# EasyEDA Pro project TLV3501.eprj

# Schematic Schematic1
Create Date: 2023-01-22; Page Name: P1; Project Name: TLV3501; Schematic Name: Schematic1; Update Date: 2023-02-03; Company: 嘉立创EDA
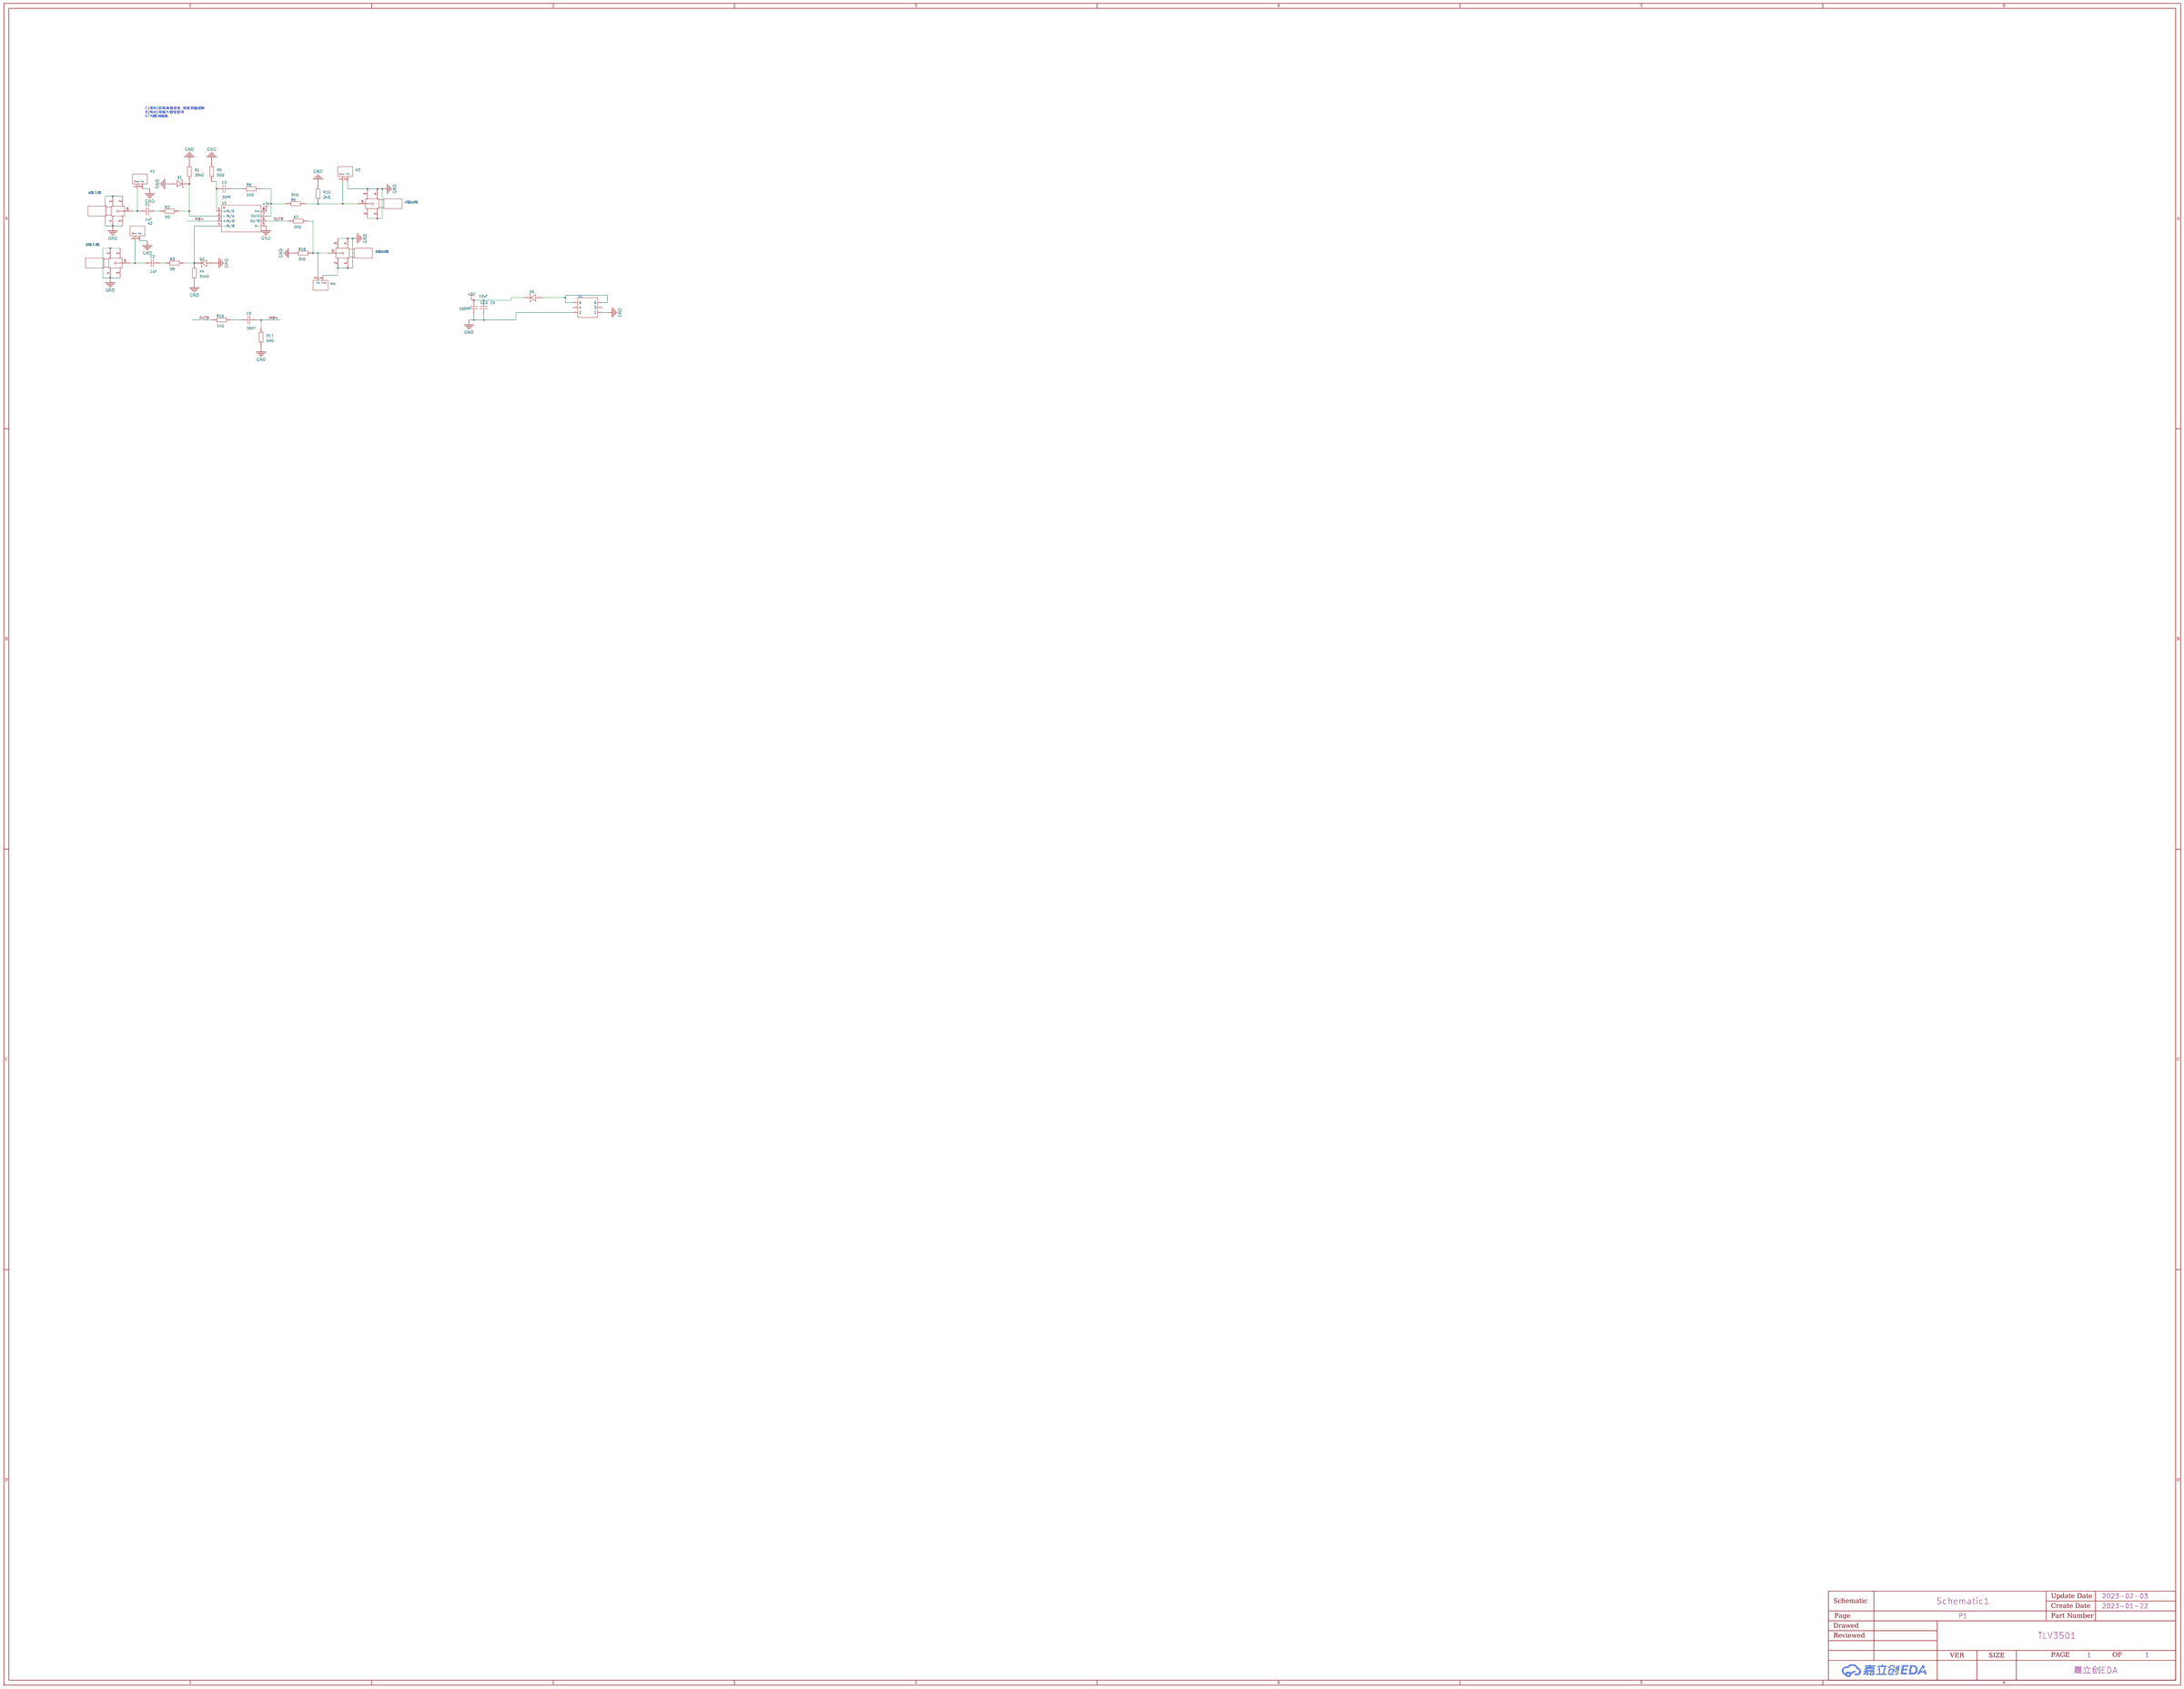
[diagram p0: schematic sheet]

## Parts
A输入端  BWSMA-KE-P001  [SMA-SMD_BWSMA-KE-P001]
A输出端  BWSMA-KE-P001  [SMA-SMD_BWSMA-KE-P001]
B输入端  BWSMA-KE-P001  [SMA-SMD_BWSMA-KE-P001]
B输出端  BWSMA-KE-P001  [SMA-SMD_BWSMA-KE-P001]
C1  1uF  [C0805]
C2  1uF  [C0805]
C3  30PF  [C0805]
C5  30PF  [C0805]
C6  10uf  [C0805]
C10  100Nf  [C0805]
D1  BAS40WS 43  [SOD-323_L1.8-W1.3-LS2.5-RD]
D2  BAS40WS 43  [SOD-323_L1.8-W1.3-LS2.5-RD]
D5  BAS40WS 43  [SOD-323_L1.8-W1.3-LS2.5-RD]
H1  PZ254V-11-02P  [HDR-TH_2P-P2.54-V-M]
H2  PZ254V-11-02P  [HDR-TH_2P-P2.54-V-M]
H3  PZ254V-11-02P  [HDR-TH_2P-P2.54-V-M]
H4  PZ254V-11-02P  [HDR-TH_2P-P2.54-V-M]
J1  2.54-2*3P针  [HDR-TH_6P-P2.54-V-M-R2-C3-S2.54-1]
R1  30kΩ  [R0805]
R2  0Ω  [R0805]
R3  0Ω  [R0805]
R4  30kΩ  [R0805]
R6  3KΩ  [R0805]
R7  3KΩ  [R0805]
R8  1kΩ  [R0805]
R9  50Ω  [R0805]
R10  2kΩ  [R0805]
R16  1kΩ  [R0805]
R17  50Ω  [R0805]
R18  2kΩ  [R0805]
U1  TLV3502AIDR  [SOIC-8_L4.9-W3.9-P1.27-LS6.0-BL]

## Library data of the parts
A输入端 A输出端 B输入端 B输出端 = BWSMA-KE-P001: 连接器类型:板端;射频系列:SMA;接口类型:内孔;端口数量:1;阻抗:-;频率-最大值:-;样式:偏脚;接口直径:5.2mm;接口长度/高度:-;工作温度范围:-;; LCSC Part Name: SMA 内孔 偏脚 SMA偏脚板端座子; Supplier Part: C496550; Manufacturer: BAT WIRELESS(蝙蝠无线); Supplier Footprint: 插件; JLCPCB Part Class: Extended Part; Datasheet: https://atta.szlcsc.com/upload/public/pdf/source/20200416/C496550_06668BF2E3B968EA39F96D17E7156373.pdf; Supplier: LCSC; Connector Type: 板端; RF Series: SMA; Interface Type: 内孔; Number of Ports: 1; Style: 偏脚; Interface Diameter: 5.2mm
C1-C3 C5 = CL21B225KAFNNNE: 容值:2.2uF;精度:±10%;额定电压:25V;材质(温度系数):X7R;; LCSC Part Name: 2.2uF ±10% 25V; Supplier Part: C19110; Manufacturer: SAMSUNG(三星); Supplier Footprint: 0805; JLCPCB Part Class: Extended Part; Datasheet: https://atta.szlcsc.com/upload/public/pdf/source/20160103/1457707702018.pdf; Supplier: LCSC; Tolerance: ±10%; Voltage Rated: 25V; Temperature Coefficient: X7R
C6 C10 = CC0805KRX7R9BB104: 容值:100nF;精度:±10%;额定电压:50V;材质(温度系数):X7R;; LCSC Part Name: 100nF ±10% 50V; Supplier Part: C49678; Manufacturer: YAGEO(国巨); Supplier Footprint: 0805; JLCPCB Part Class: Basic Part; Datasheet: https://atta.szlcsc.com/upload/public/pdf/source/20151026/1457707504898.pdf; Supplier: LCSC; Tolerance: ±10%; Voltage Rated: 50V; Temperature Coefficient: X7R
D1 D2 D5 = BAS40WS 43: 直流反向耐压(Vr):40V;平均整流电流(Io):200mA;正向压降(Vf):1V@40mA;; LCSC Part Name: 40V 200mA 1V@40mA; Supplier Part: C22648; Manufacturer: CJ(江苏长电/长晶); Supplier Footprint: SOD-323; JLCPCB Part Class: Extended Part; Datasheet: https://atta.szlcsc.com/upload/public/pdf/source/20161217/1481939122594.pdf; Supplier: LCSC; Reverse Voltage (Vr): 40V; Average Rectified Current (Io): 200mA; Forward Voltage (Vf@If): 1V@40mA
H1-H4 = PZ254V-11-02P: 排数:单排;总PIN位数:2;间距:2.54mm;插针结构:1x2P;行距:-;安装类型:直插;圆针/方针:方针;额定电流:-;额定电压:-;配合针长度:6mm;塑高:2.5mm;端接针长度:3mm;触头材质:黄铜;触头镀层:-;工作温度范围:-40~+105;颜色:黑色;; LCSC Part Name: 2.54mm 1x2P 直插 方针; Supplier Part: C492401; Manufacturer: XFCN(兴飞); Supplier Footprint: 直插,P=2.54mm; JLCPCB Part Class: Extended Part; Datasheet: https://atta.szlcsc.com/upload/public/pdf/source/20200309/C492401_A812433581A9B211A7FFA413ADDFF0E5.pdf; Supplier: LCSC; Number of Rows: 单排; Number of Pins: 2; Pitch: 2.54mm; Pin Structure: 1x2P; Mounting Type: 直插; Circluar Pins/Square Pins: 方针; Length of Mating Pin: 6mm; Insulation Height: 2.5mm; Length of End Connection Pin: 3mm; Contact Material: 黄铜; Operating Temperature Range: -40~+105; Color: 黑色
J1 = 2.54-2*3P针: 排数:双排;总PIN位数:6;间距:2.54mm;插针结构:-;行距:-;安装类型:直插;圆针/方针:-;额定电流:-;额定电压:-;配合针长度:-;塑高:-;触头材质:-;触头镀层:-;颜色:黑色;; LCSC Part Name: 2.54mm 直插; Supplier Part: C65114; Manufacturer: BOOMELE(博穆精密); Supplier Footprint: 插件,P=2.54mm; JLCPCB Part Class: Extended Part; Supplier: LCSC; Number of Rows: 双排; Number of Pins: 6; Pitch: 2.54mm; Mounting Type: 直插; Color: 黑色
R1-R4 R6-R10 R16-R18 = 0805W8F1002T5E_C17414: 电阻类型:厚膜电阻;阻值:10kΩ;精度:±1%;功率:125mW;温度系数:±100ppm/;最大工作电压:150V;工作温度范围:-55~+155;; LCSC Part Name: 10kΩ ±1% 125mW; Supplier Part: C17414; Manufacturer: UNI-ROYAL(厚声); Manufacturer Part: 0805W8F1002T5E; Supplier Footprint: 0805; JLCPCB Part Class: Basic Part; Datasheet: https://atta.szlcsc.com/upload/public/pdf/source/20200306/C422600_1E6D84923E4A46A82E41ADD87F860B5C.pdf; Supplier: LCSC; Type: 厚膜电阻; Tolerance: ±1%; Power(Watts): 125mW; Temperature Coefficient: ±100ppm/; Overload Voltage (Max): 150V; Operating Temperature Range: -55~+155
U1 = TLV3502AIDR: TLV3502 4.5ns 轨至轨比较器; Supplier Part: C131165; Manufacturer: TI(德州仪器); Supplier Footprint: SOIC-8; JLCPCB Part Class: Extended Part; Datasheet: https://atta.szlcsc.com/upload/public/pdf/source/20171026/C131165_15089839567681058795.pdf; Supplier: LCSC

## Nets
+5V: C6.2 C10.2 D5.1(K) U1.8(V+)
GND: A输入端.1 A输入端.2 A输入端.3 A输入端.4 A输出端.1 A输出端.2 A输出端.3 A输出端.4 B输入端.1 B输入端.2 B输入端.3 B输入端.4 B输出端.1 B输出端.2 B输出端.3 B输出端.4 C6.1 C10.1 D1.2(A) D2.2(A) H1.2 H2.2 H3.2 H4.1 J1.1 J1.2 R1.1 R4.1 R9.1 R10.1 R17.1 R18.1 U1.5(V-)
INB+: C5.1 R17.2 U1.3(+IN/B)
OUTB: R7.1 R16.2 U1.6(OUTB)
$1N945: C1.2 R2.2
$1N1315: C2.2 R3.2
$1N14477: C3.2 R8.1
$1N15857: C5.2 R16.1
Net-(A输入端-5): A输入端.5 C1.1 H1.1
Net-(A输出端-5): A输出端.5 H3.1 R6.2 R10.2
Net-(B输入端-5): B输入端.5 C2.1 H2.1
Net-(B输出端-5): B输出端.5 H4.2 R7.2 R18.2
Net-(C3-1): C3.1 R9.2 U1.1(+IN/A)
Net-(D1-1): D1.1(K) R1.2 R2.1 U1.2(-IN/A)
Net-(D2-1): D2.1(K) R3.1 R4.2 U1.4(-IN/B)
Net-(D5-2): D5.2(A) J1.5 J1.6
Net-(R6-1): R6.1 R8.2 U1.7(OUTA)

Not connected (* = marked no-connect by the designer): J1 3 4

## Notes on the sheet
- C1和R1实现高通滤波，将直流量滤除
  R2和R1将输入信号衰减
  R7为限流电阻

# Schematic Schematic3
Create Date: 2023-02-16; Page Name: P1; Project Name: TLV3501; Schematic Name: Schematic3; Update Date: 2023-02-16; Company: 嘉立创EDA
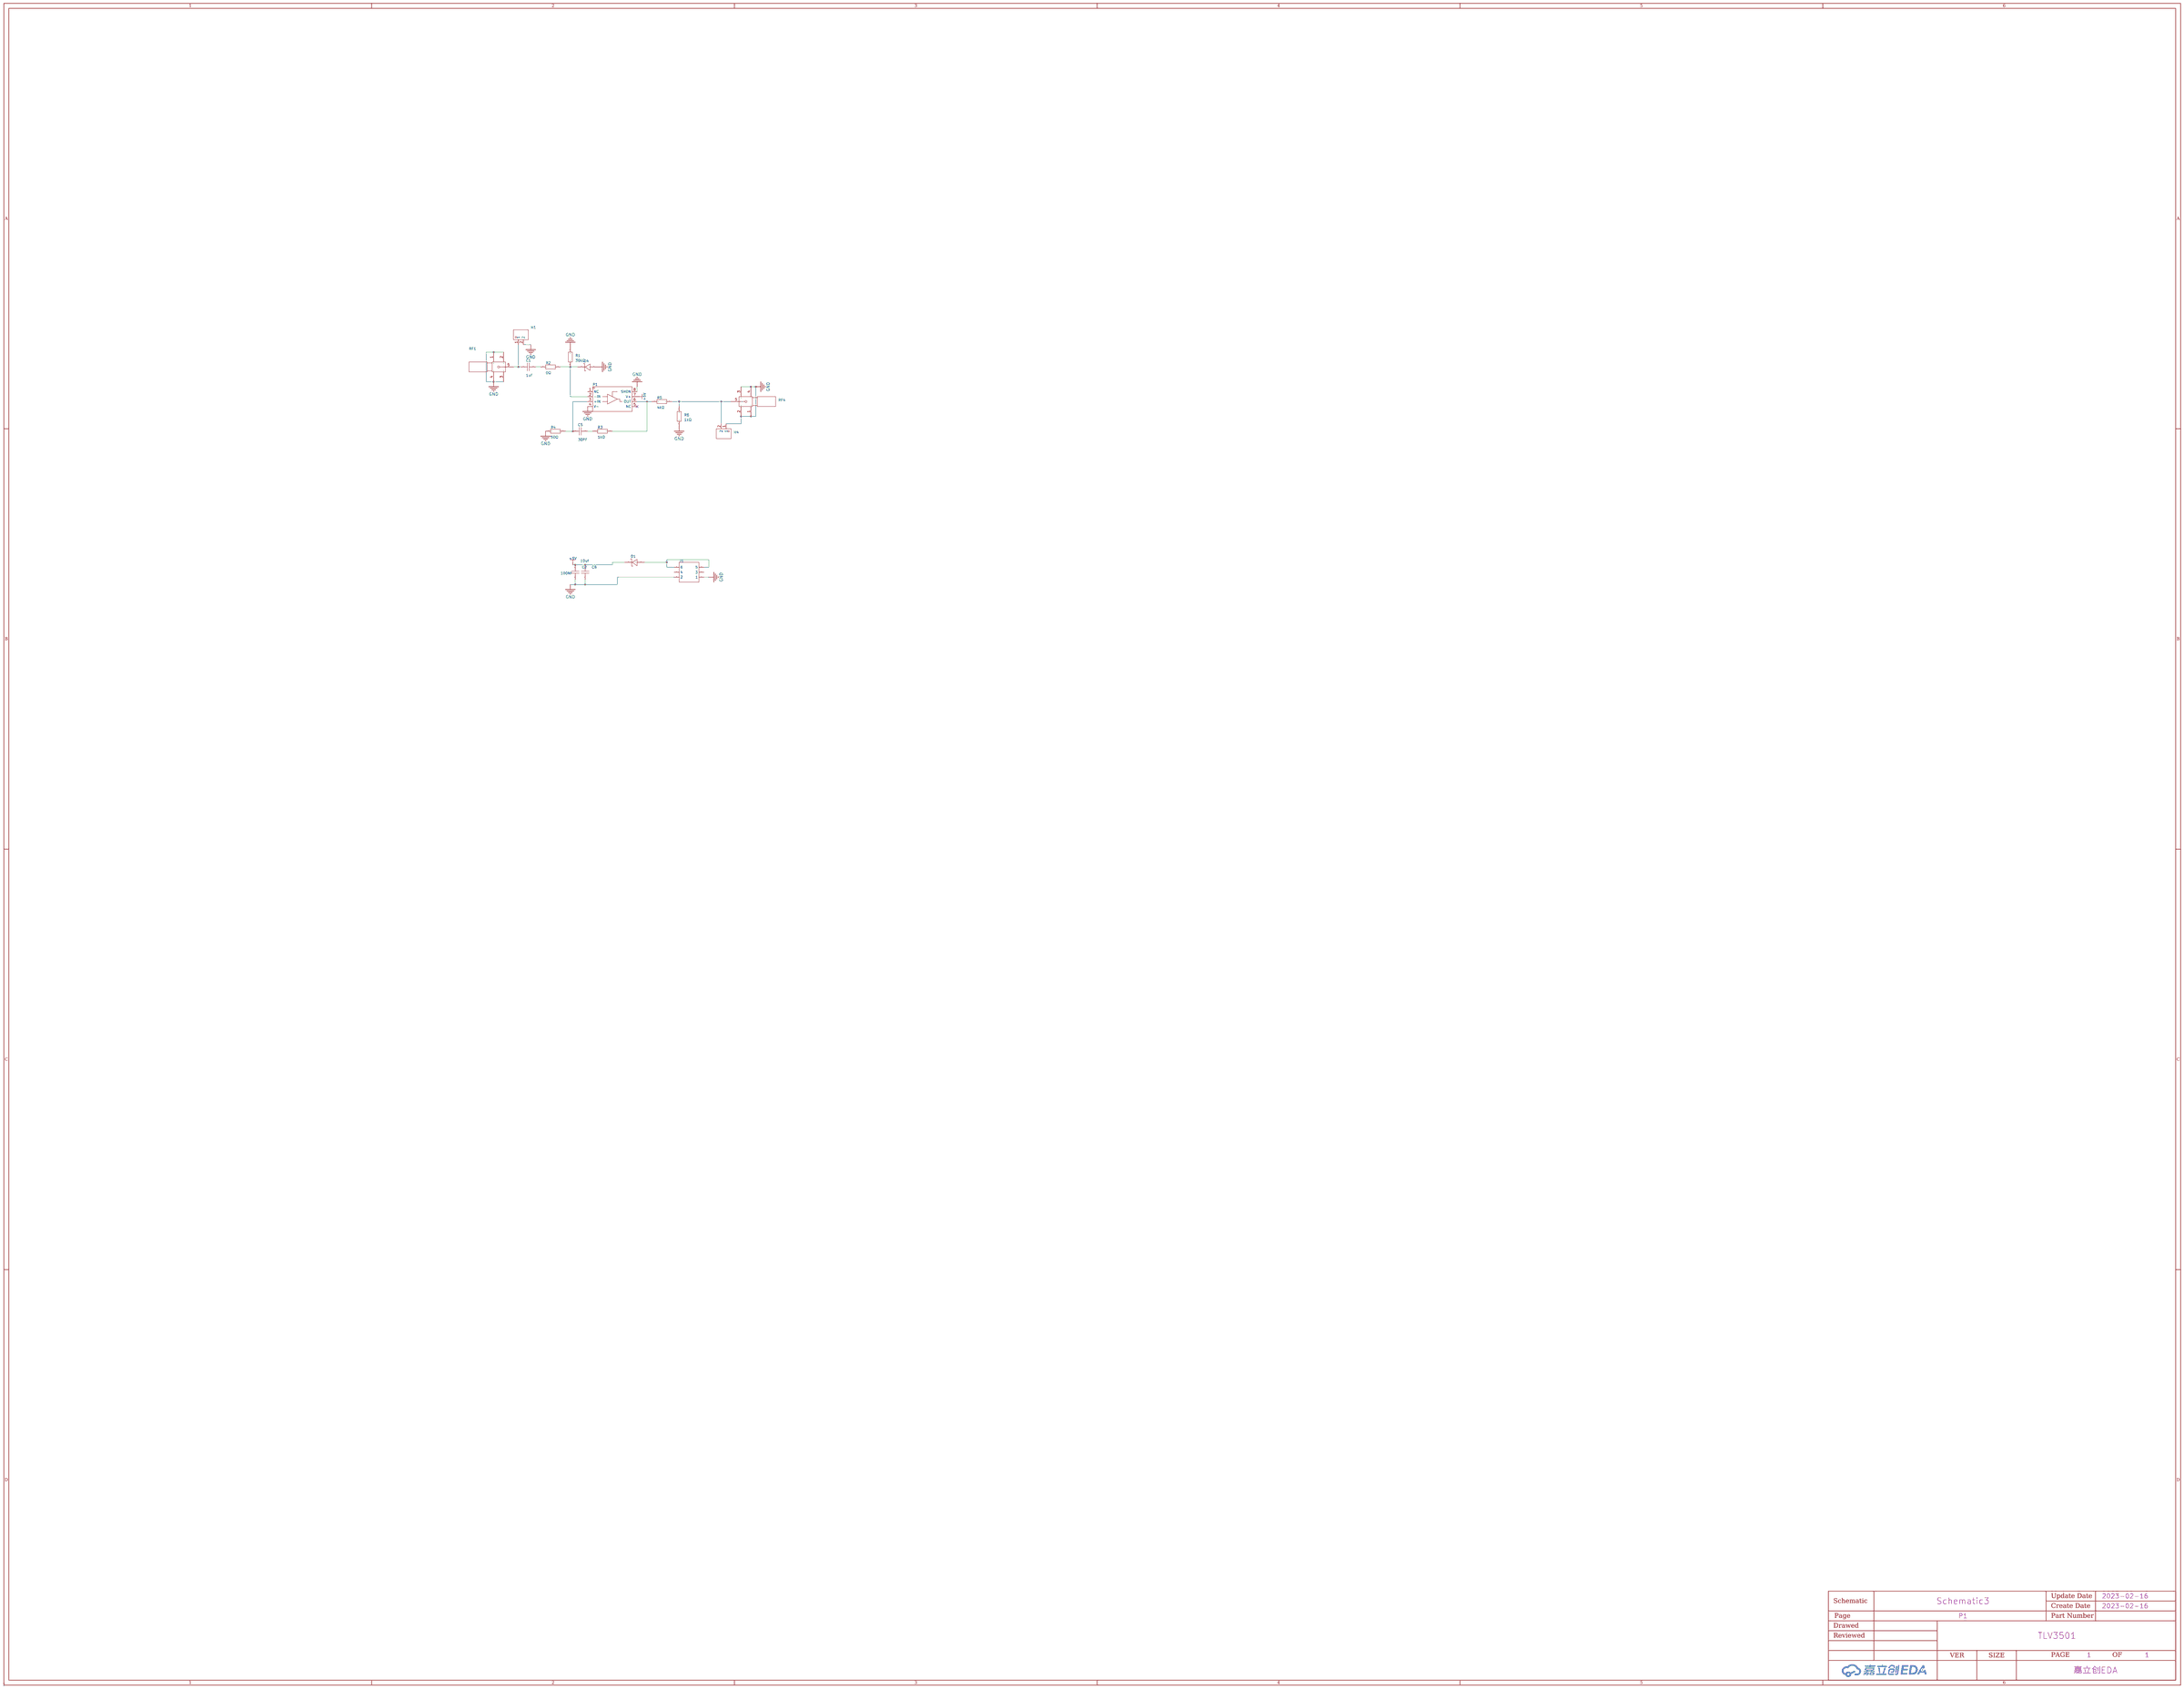
[diagram p1: schematic sheet]

## Parts
C1  1uF  [C0805]
C2  100Nf  [C0805]
C5  30PF  [C0805]
C8  10uf  [C0805]
D1  BAS40WS 43  [SOD-323_L1.8-W1.3-LS2.5-RD]
D4  BAS40WS 43  [SOD-323_L1.8-W1.3-LS2.5-RD]
H1  PZ254V-11-02P  [HDR-TH_2P-P2.54-V-M]
H4  PZ254V-11-02P  [HDR-TH_2P-P2.54-V-M]
J1  2.54-2*3P针  [HDR-TH_6P-P2.54-V-M-R2-C3-S2.54-1]
P1  TLV3501AIDR  [SOP-8_L4.9-W3.9-P1.27-LS6.0-BL]
R1  30kΩ  [R0805]
R2  0Ω  [R0805]
R3  1kΩ  [R0805]
R4  50Ω  [R0805]
R5  4kΩ  [R0805]
R6  1kΩ  [R0805]
RF1  BWSMA-KE-P001  [SMA-SMD_BWSMA-KE-P001]
RF4  BWSMA-KE-P001  [SMA-SMD_BWSMA-KE-P001]

## Library data of the parts
C1 C5 = CL21B225KAFNNNE: 容值:2.2uF;精度:±10%;额定电压:25V;材质(温度系数):X7R;; LCSC Part Name: 2.2uF ±10% 25V; Supplier Part: C19110; Manufacturer: SAMSUNG(三星); Supplier Footprint: 0805; JLCPCB Part Class: Extended Part; Datasheet: https://atta.szlcsc.com/upload/public/pdf/source/20160103/1457707702018.pdf; Supplier: LCSC; Tolerance: ±10%; Voltage Rated: 25V; Temperature Coefficient: X7R
C2 C8 = CC0805KRX7R9BB104: 容值:100nF;精度:±10%;额定电压:50V;材质(温度系数):X7R;; LCSC Part Name: 100nF ±10% 50V; Supplier Part: C49678; Manufacturer: YAGEO(国巨); Supplier Footprint: 0805; JLCPCB Part Class: Basic Part; Datasheet: https://atta.szlcsc.com/upload/public/pdf/source/20151026/1457707504898.pdf; Supplier: LCSC; Tolerance: ±10%; Voltage Rated: 50V; Temperature Coefficient: X7R
D1 D4 = BAS40WS 43: 直流反向耐压(Vr):40V;平均整流电流(Io):200mA;正向压降(Vf):1V@40mA;; LCSC Part Name: 40V 200mA 1V@40mA; Supplier Part: C22648; Manufacturer: CJ(江苏长电/长晶); Supplier Footprint: SOD-323; JLCPCB Part Class: Extended Part; Datasheet: https://atta.szlcsc.com/upload/public/pdf/source/20161217/1481939122594.pdf; Supplier: LCSC; Reverse Voltage (Vr): 40V; Average Rectified Current (Io): 200mA; Forward Voltage (Vf@If): 1V@40mA
H1 H4 = PZ254V-11-02P: 排数:单排;总PIN位数:2;间距:2.54mm;插针结构:1x2P;行距:-;安装类型:直插;圆针/方针:方针;额定电流:-;额定电压:-;配合针长度:6mm;塑高:2.5mm;端接针长度:3mm;触头材质:黄铜;触头镀层:-;工作温度范围:-40~+105;颜色:黑色;; LCSC Part Name: 2.54mm 1x2P 直插 方针; Supplier Part: C492401; Manufacturer: XFCN(兴飞); Supplier Footprint: 直插,P=2.54mm; JLCPCB Part Class: Extended Part; Datasheet: https://atta.szlcsc.com/upload/public/pdf/source/20200309/C492401_A812433581A9B211A7FFA413ADDFF0E5.pdf; Supplier: LCSC; Number of Rows: 单排; Number of Pins: 2; Pitch: 2.54mm; Pin Structure: 1x2P; Mounting Type: 直插; Circluar Pins/Square Pins: 方针; Length of Mating Pin: 6mm; Insulation Height: 2.5mm; Length of End Connection Pin: 3mm; Contact Material: 黄铜; Operating Temperature Range: -40~+105; Color: 黑色
J1 = 2.54-2*3P针: 排数:双排;总PIN位数:6;间距:2.54mm;插针结构:-;行距:-;安装类型:直插;圆针/方针:-;额定电流:-;额定电压:-;配合针长度:-;塑高:-;触头材质:-;触头镀层:-;颜色:黑色;; LCSC Part Name: 2.54mm 直插; Supplier Part: C65114; Manufacturer: BOOMELE(博穆精密); Supplier Footprint: 插件,P=2.54mm; JLCPCB Part Class: Extended Part; Supplier: LCSC; Number of Rows: 双排; Number of Pins: 6; Pitch: 2.54mm; Mounting Type: 直插; Color: 黑色
P1 = TLV3501AIDR: 比较器组数:1;电源电压:2.7V ~ 5.5V, ±1.35V ~ 2.75V;各通道供电电流:5mA;输出类型:CMOS, Push-Pull, Rail-to-Rail, TTL;传播延迟:10ns;; Supplier Part: C43484; Manufacturer: TI(德州仪器); Supplier Footprint: SOP-8_150mil; JLCPCB Part Class: Extended Part; Datasheet: https://atta.szlcsc.com/upload/public/pdf/source/20150319/1457707268212.pdf; Supplier: LCSC; Number of Elements: 1; Supply Voltage（Single）: 2.7V ~ 5.5V, ±1.35V ~ 2.75V; Iq per channel (Typ): 5mA; Output Type: CMOS, Push-Pull, Rail-to-Rail, TTL; Propagation Delay (Max): 10ns; Operating Temperature: -40°C ~ 125°C
R1-R6 = 0805W8F1002T5E_C17414: 电阻类型:厚膜电阻;阻值:10kΩ;精度:±1%;功率:125mW;温度系数:±100ppm/;最大工作电压:150V;工作温度范围:-55~+155;; LCSC Part Name: 10kΩ ±1% 125mW; Supplier Part: C17414; Manufacturer: UNI-ROYAL(厚声); Manufacturer Part: 0805W8F1002T5E; Supplier Footprint: 0805; JLCPCB Part Class: Basic Part; Datasheet: https://atta.szlcsc.com/upload/public/pdf/source/20200306/C422600_1E6D84923E4A46A82E41ADD87F860B5C.pdf; Supplier: LCSC; Type: 厚膜电阻; Tolerance: ±1%; Power(Watts): 125mW; Temperature Coefficient: ±100ppm/; Overload Voltage (Max): 150V; Operating Temperature Range: -55~+155
RF1 RF4 = BWSMA-KE-P001: 连接器类型:板端;射频系列:SMA;接口类型:内孔;端口数量:1;阻抗:-;频率-最大值:-;样式:偏脚;接口直径:5.2mm;接口长度/高度:-;工作温度范围:-;; LCSC Part Name: SMA 内孔 偏脚 SMA偏脚板端座子; Supplier Part: C496550; Manufacturer: BAT WIRELESS(蝙蝠无线); Supplier Footprint: 插件; JLCPCB Part Class: Extended Part; Datasheet: https://atta.szlcsc.com/upload/public/pdf/source/20200416/C496550_06668BF2E3B968EA39F96D17E7156373.pdf; Supplier: LCSC; Connector Type: 板端; RF Series: SMA; Interface Type: 内孔; Number of Ports: 1; Style: 偏脚; Interface Diameter: 5.2mm

## Nets
+5V: C2.2 C8.2 D1.1(K) P1.7(V+)
GND: C2.1 C8.1 D4.2(A) H1.2 H4.1 J1.1 J1.2 P1.4(V-) P1.8(SHDN) R1.1 R4.1 R6.1 RF1.1 RF1.2 RF1.3 RF1.4 RF4.1 RF4.2 RF4.3 RF4.4
$1N1068: C1.2 R2.2
$1N1963: D4.1(K) P1.2(-IN) R1.2 R2.1
$1N2302: C5.2 R3.1
$1N2385: C5.1 P1.3(+IN) R4.2
$1N2597: P1.6(OUT) R3.2 R5.1
Net-(C1-1): C1.1 H1.1 RF1.5
Net-(D1-2): D1.2(A) J1.5 J1.6
Net-(H4-2): H4.2 R5.2 R6.2 RF4.5

Not connected (* = marked no-connect by the designer): J1 3 4; P1 1(NC) 5(NC)*

# Schematic Schematic4
Create Date: 2023-04-01; Page Name: P1; Project Name: TLV3501; Schematic Name: Schematic4; Update Date: 2023-04-01; Company: 嘉立创EDA
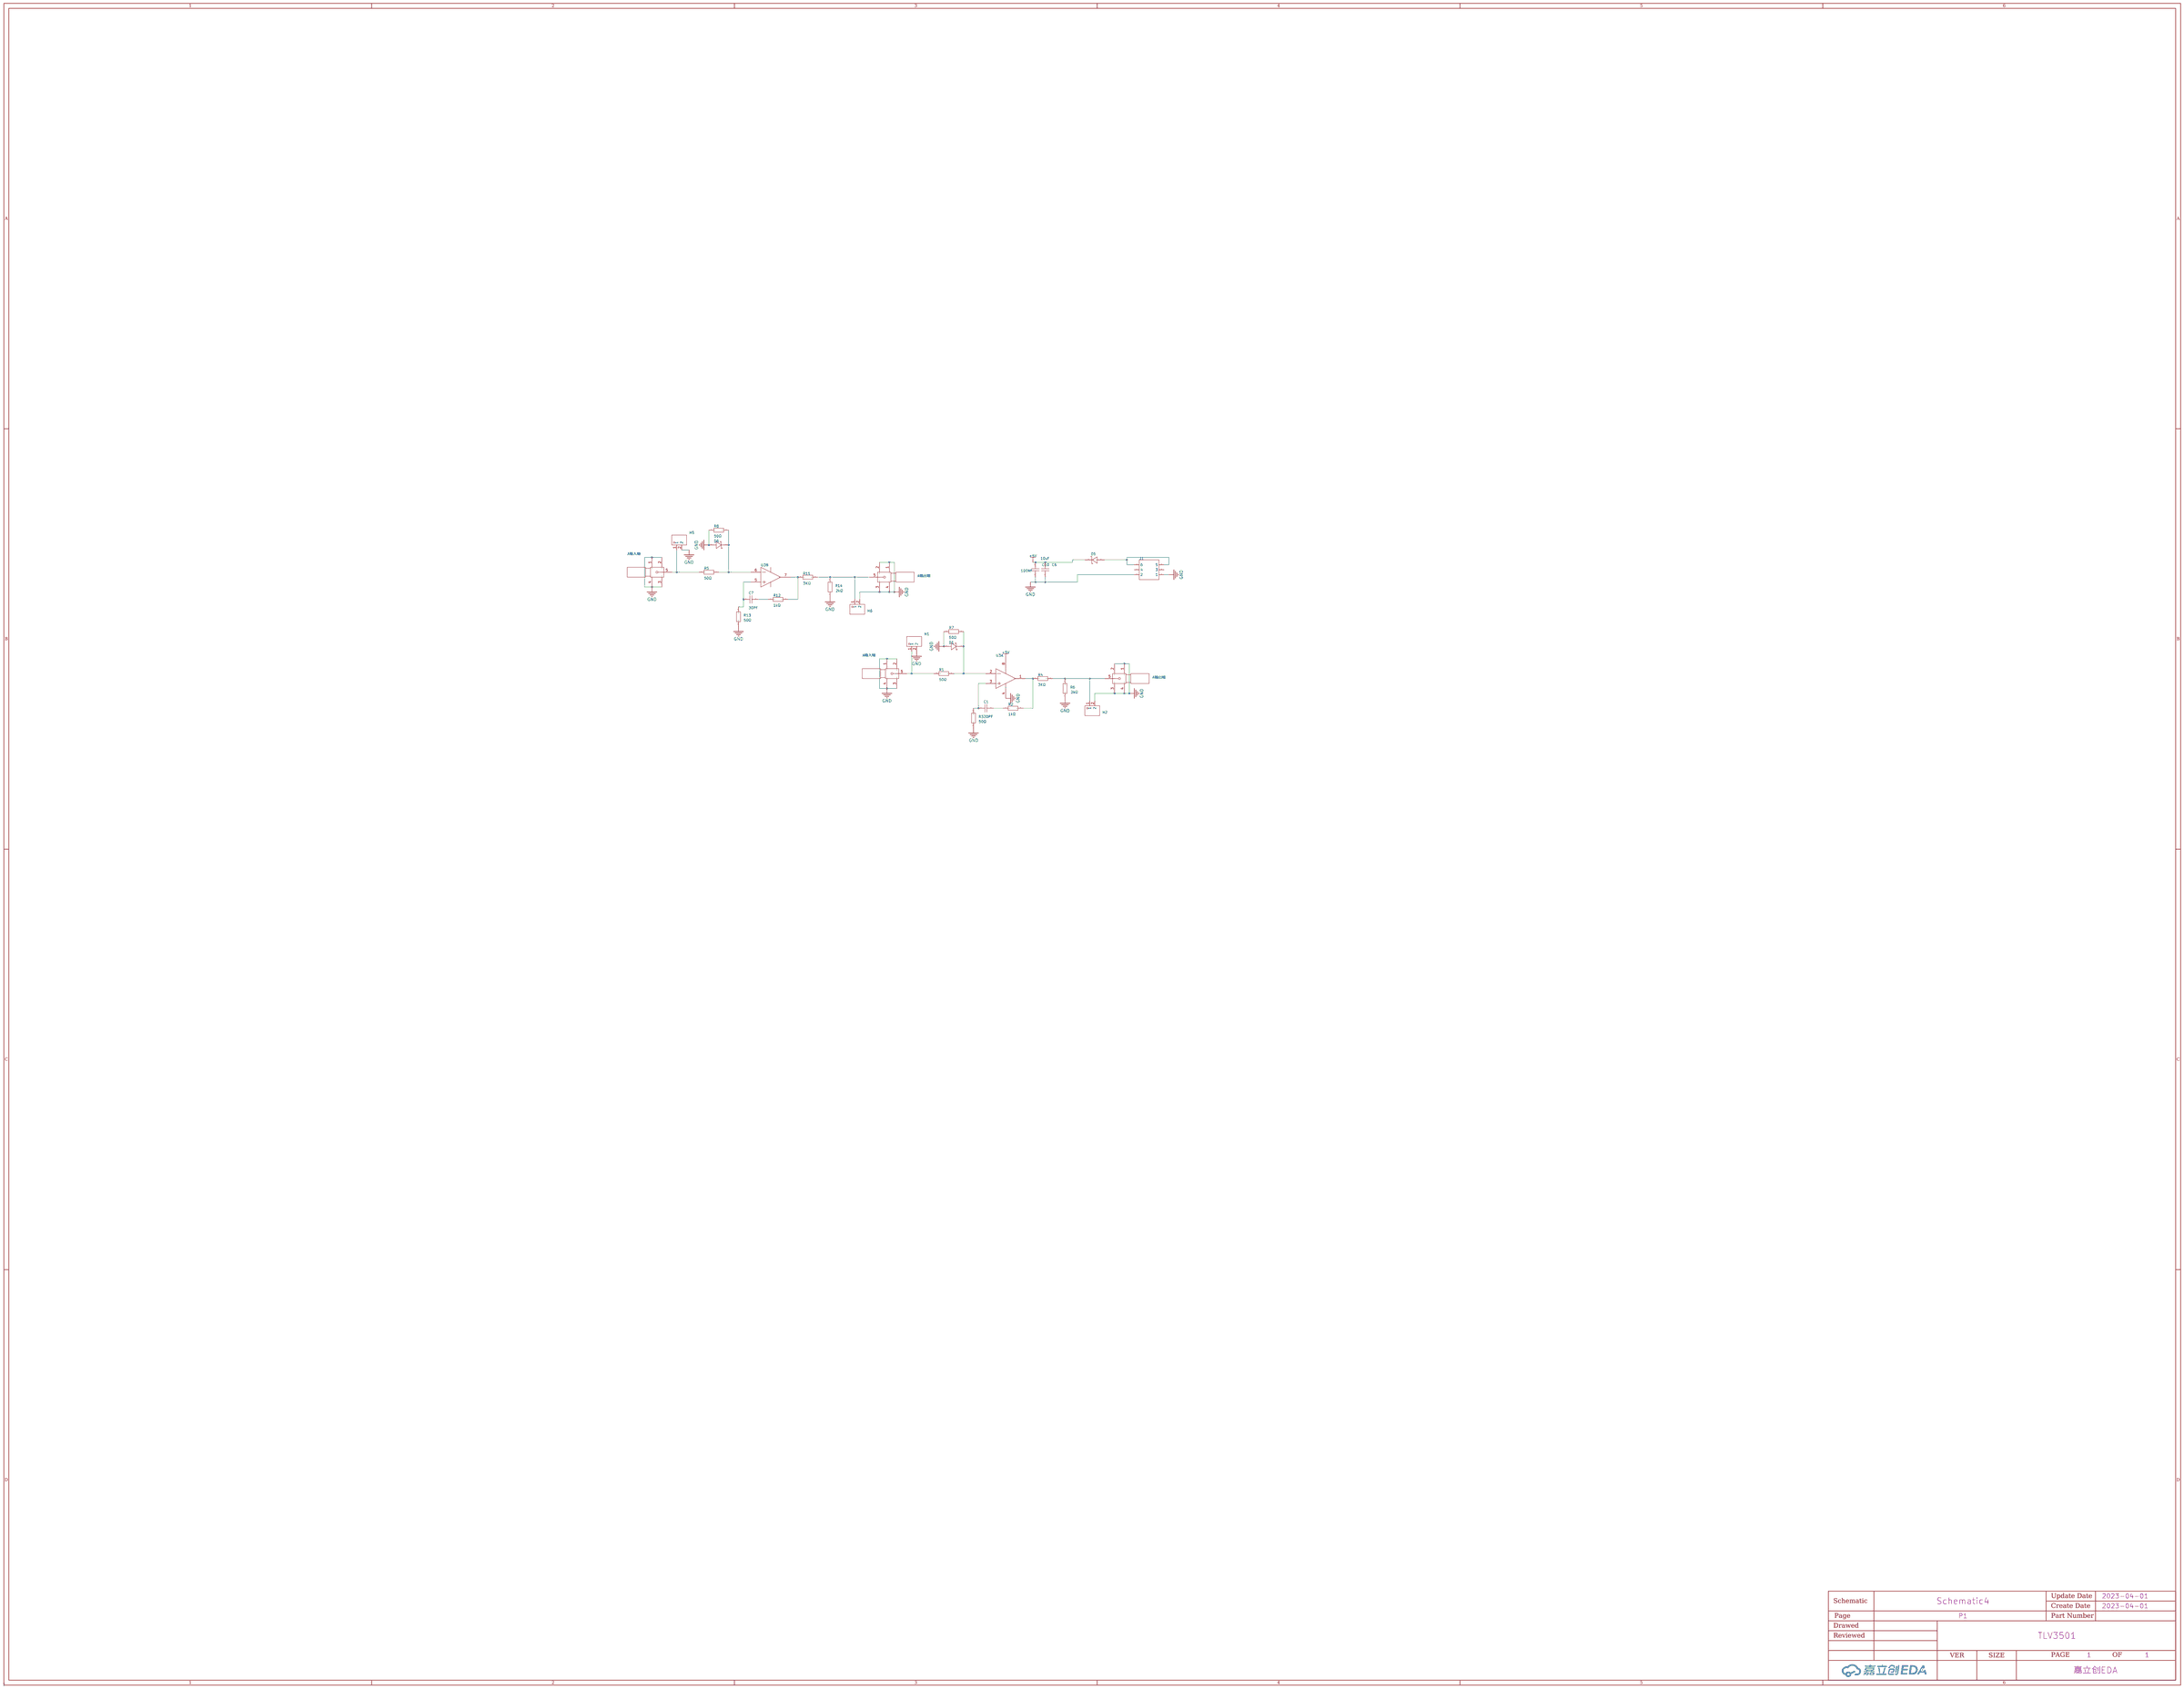
[diagram p2: schematic sheet]

## Parts
A输入端  BWSMA-KE-P001  [SMA-SMD_BWSMA-KE-P001]
A输入端#2  BWSMA-KE-P001  [SMA-SMD_BWSMA-KE-P001]
A输出端  BWSMA-KE-P001  [SMA-SMD_BWSMA-KE-P001]
A输出端#2  BWSMA-KE-P001  [SMA-SMD_BWSMA-KE-P001]
C1  30PF  [C0805]
C6  10uf  [C0805]
C7  30PF  [C0805]
C10  100Nf  [C0805]
D1  1N5817W  [SOD-123_L2.8-W1.8-LS3.7-RD]
D5  BAS40WS 43  [SOD-323_L1.8-W1.3-LS2.5-RD]
D6  1N5817W  [SOD-123_L2.8-W1.8-LS3.7-RD]
H1  PZ254V-11-02P  [HDR-TH_2P-P2.54-V-M]
H2  PZ254V-11-02P  [HDR-TH_2P-P2.54-V-M]
H5  PZ254V-11-02P  [HDR-TH_2P-P2.54-V-M]
H6  PZ254V-11-02P  [HDR-TH_2P-P2.54-V-M]
J1  2.54-2*3P针  [HDR-TH_6P-P2.54-V-M-R2-C3-S2.54-1]
R1  50Ω  [R0805]
R2  1kΩ  [R0805]
R3  50Ω  [R0805]
R4  3KΩ  [R0805]
R5  50Ω  [R0805]
R6  2kΩ  [R0805]
R7  50Ω  [R0805]
R8  50Ω  [R0805]
R11  3KΩ  [R0805]
R12  1kΩ  [R0805]
R13  50Ω  [R0805]
R14  2kΩ  [R0805]
U3  TLV3202AQDGKRQ1  [VSSOP-8_L3.0-W3.0-P0.65-LS4.9-BL]  (sections 1,2)

## Library data of the parts
A输入端 A输入端#2 A输出端 A输出端#2 = BWSMA-KE-P001: 连接器类型:板端;射频系列:SMA;接口类型:内孔;端口数量:1;阻抗:-;频率-最大值:-;样式:偏脚;接口直径:5.2mm;接口长度/高度:-;工作温度范围:-;; LCSC Part Name: SMA 内孔 偏脚 SMA偏脚板端座子; Supplier Part: C496550; Manufacturer: BAT WIRELESS(蝙蝠无线); Supplier Footprint: 插件; JLCPCB Part Class: Extended Part; Datasheet: https://atta.szlcsc.com/upload/public/pdf/source/20200416/C496550_06668BF2E3B968EA39F96D17E7156373.pdf; Supplier: LCSC; Connector Type: 板端; RF Series: SMA; Interface Type: 内孔; Number of Ports: 1; Style: 偏脚; Interface Diameter: 5.2mm
C1 C7 = CL21B225KAFNNNE: 容值:2.2uF;精度:±10%;额定电压:25V;材质(温度系数):X7R;; LCSC Part Name: 2.2uF ±10% 25V; Supplier Part: C19110; Manufacturer: SAMSUNG(三星); Supplier Footprint: 0805; JLCPCB Part Class: Extended Part; Datasheet: https://atta.szlcsc.com/upload/public/pdf/source/20160103/1457707702018.pdf; Supplier: LCSC; Tolerance: ±10%; Voltage Rated: 25V; Temperature Coefficient: X7R
C6 C10 = CC0805KRX7R9BB104: 容值:100nF;精度:±10%;额定电压:50V;材质(温度系数):X7R;; LCSC Part Name: 100nF ±10% 50V; Supplier Part: C49678; Manufacturer: YAGEO(国巨); Supplier Footprint: 0805; JLCPCB Part Class: Basic Part; Datasheet: https://atta.szlcsc.com/upload/public/pdf/source/20151026/1457707504898.pdf; Supplier: LCSC; Tolerance: ±10%; Voltage Rated: 50V; Temperature Coefficient: X7R
D1 D6 = 1N5817W: 二极管配置:独立式;直流反向耐压(Vr):20V;平均整流电流(Io):1A;正向压降(Vf):750mV@3A;反向电流(Ir):1mA@20V;; LCSC Part Name: 20V 1A 750mV@3A; Supplier Part: C727113; Manufacturer: TWGMC(台湾迪嘉); Supplier Footprint: SOD-123; JLCPCB Part Class: Extended Part; Datasheet: https://atta.szlcsc.com/upload/public/pdf/source/20200828/C727113_260B72EC53C389C21DF1E8AB243F1BFC.pdf; Supplier: LCSC; Diode Configuration: 独立式; Reverse Voltage (Vr): 20V; Average Rectified Current (Io): 1A; Forward Voltage (Vf@If): 750mV@3A; Reverse Leakage Current (Ir): 1mA@20V
D5 = BAS40WS 43: 直流反向耐压(Vr):40V;平均整流电流(Io):200mA;正向压降(Vf):1V@40mA;; LCSC Part Name: 40V 200mA 1V@40mA; Supplier Part: C22648; Manufacturer: CJ(江苏长电/长晶); Supplier Footprint: SOD-323; JLCPCB Part Class: Extended Part; Datasheet: https://atta.szlcsc.com/upload/public/pdf/source/20161217/1481939122594.pdf; Supplier: LCSC; Reverse Voltage (Vr): 40V; Average Rectified Current (Io): 200mA; Forward Voltage (Vf@If): 1V@40mA
H1 H2 H5 H6 = PZ254V-11-02P: 排数:单排;总PIN位数:2;间距:2.54mm;插针结构:1x2P;行距:-;安装类型:直插;圆针/方针:方针;额定电流:-;额定电压:-;配合针长度:6mm;塑高:2.5mm;端接针长度:3mm;触头材质:黄铜;触头镀层:-;工作温度范围:-40~+105;颜色:黑色;; LCSC Part Name: 2.54mm 1x2P 直插 方针; Supplier Part: C492401; Manufacturer: XFCN(兴飞); Supplier Footprint: 直插,P=2.54mm; JLCPCB Part Class: Extended Part; Datasheet: https://atta.szlcsc.com/upload/public/pdf/source/20200309/C492401_A812433581A9B211A7FFA413ADDFF0E5.pdf; Supplier: LCSC; Number of Rows: 单排; Number of Pins: 2; Pitch: 2.54mm; Pin Structure: 1x2P; Mounting Type: 直插; Circluar Pins/Square Pins: 方针; Length of Mating Pin: 6mm; Insulation Height: 2.5mm; Length of End Connection Pin: 3mm; Contact Material: 黄铜; Operating Temperature Range: -40~+105; Color: 黑色
J1 = 2.54-2*3P针: 排数:双排;总PIN位数:6;间距:2.54mm;插针结构:-;行距:-;安装类型:直插;圆针/方针:-;额定电流:-;额定电压:-;配合针长度:-;塑高:-;触头材质:-;触头镀层:-;颜色:黑色;; LCSC Part Name: 2.54mm 直插; Supplier Part: C65114; Manufacturer: BOOMELE(博穆精密); Supplier Footprint: 插件,P=2.54mm; JLCPCB Part Class: Extended Part; Supplier: LCSC; Number of Rows: 双排; Number of Pins: 6; Pitch: 2.54mm; Mounting Type: 直插; Color: 黑色
R1-R8 R11-R14 = 0805W8F1002T5E_C17414: 电阻类型:厚膜电阻;阻值:10kΩ;精度:±1%;功率:125mW;温度系数:±100ppm/;最大工作电压:150V;工作温度范围:-55~+155;; LCSC Part Name: 10kΩ ±1% 125mW; Supplier Part: C17414; Manufacturer: UNI-ROYAL(厚声); Manufacturer Part: 0805W8F1002T5E; Supplier Footprint: 0805; JLCPCB Part Class: Basic Part; Datasheet: https://atta.szlcsc.com/upload/public/pdf/source/20200306/C422600_1E6D84923E4A46A82E41ADD87F860B5C.pdf; Supplier: LCSC; Type: 厚膜电阻; Tolerance: ±1%; Power(Watts): 125mW; Temperature Coefficient: ±100ppm/; Overload Voltage (Max): 150V; Operating Temperature Range: -55~+155
U3 = TLV3202AQDGKRQ1: 双路高速低功耗比较器 8-VSSOP -40 to 125; Supplier Part: C2863565; Manufacturer: TI(德州仪器); Supplier Footprint: VSSOP-8-0.65mm; JLCPCB Part Class: Extended Part; Supplier: LCSC

## Nets
+5V: C6.2 C10.2 D5.1(K) U3.8(VCC)
GND: A输入端.1 A输入端.2 A输入端.3 A输入端.4 A输入端#2.1 A输入端#2.2 A输入端#2.3 A输入端#2.4 A输出端.1 A输出端.2 A输出端.3 A输出端.4 A输出端#2.1 A输出端#2.2 A输出端#2.3 A输出端#2.4 C6.1 C10.1 D1.2(A) D6.2(A) H1.2 H2.2 H5.2 H6.2 J1.1 J1.2 R3.1 R6.1 R7.2 R8.2 R13.1 R14.1 U3.4(GND)
$1N3734: C7.2 R12.1
$1N4106: C7.1 R13.2 U3.5(2IN+)
$1N4185: R11.1 R12.2 U3.7(2OUT)
$1N5698: C1.2 R2.1
$1N5699: C1.1 R3.2 U3.3(1IN+)
$1N5700: R2.2 R4.1 U3.1(1OUT)
$1N6411: D1.1(C) R1.1 R7.1 U3.2(1IN-)
$1N6737: D6.1(C) R5.1 R8.1 U3.6(2IN-)
Net-(A输入端#2-5): A输入端#2.5 H1.1 R1.2
Net-(A输入端-5): A输入端.5 H5.1 R5.2
Net-(A输出端#2-5): A输出端#2.5 H2.1 R4.2 R6.2
Net-(A输出端-5): A输出端.5 H6.1 R11.2 R14.2
Net-(D5-2): D5.2(A) J1.5 J1.6

Not connected (* = marked no-connect by the designer): J1 3 4

# Board PCB1
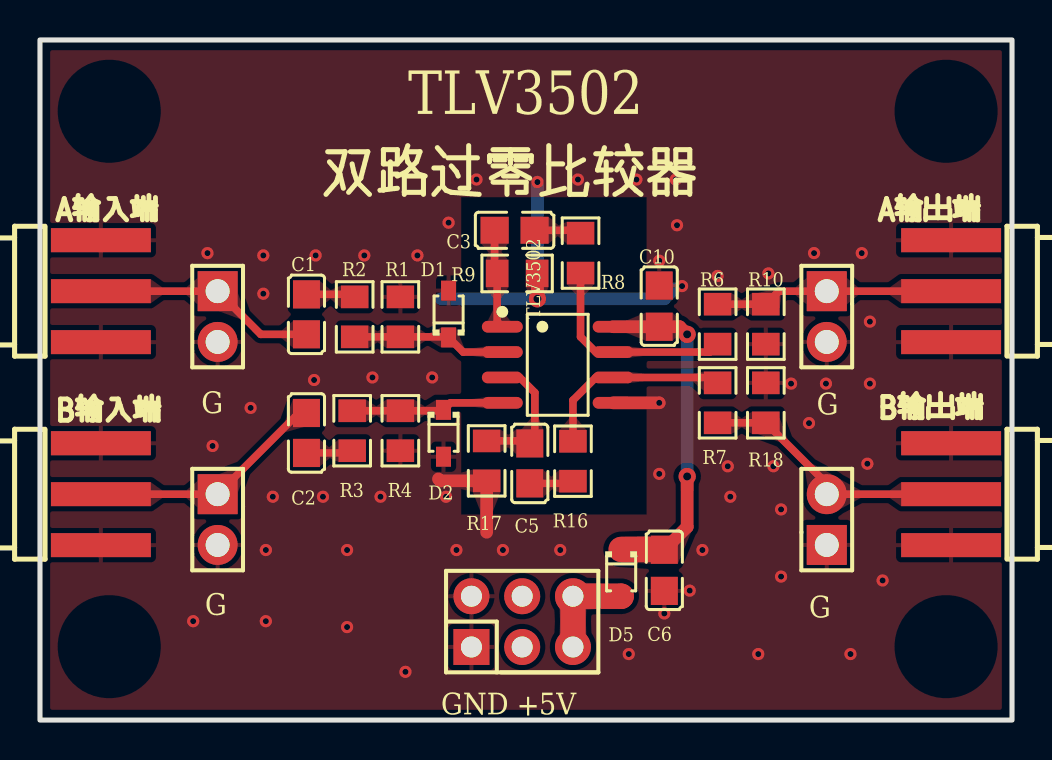
[diagram p3: board, top side]
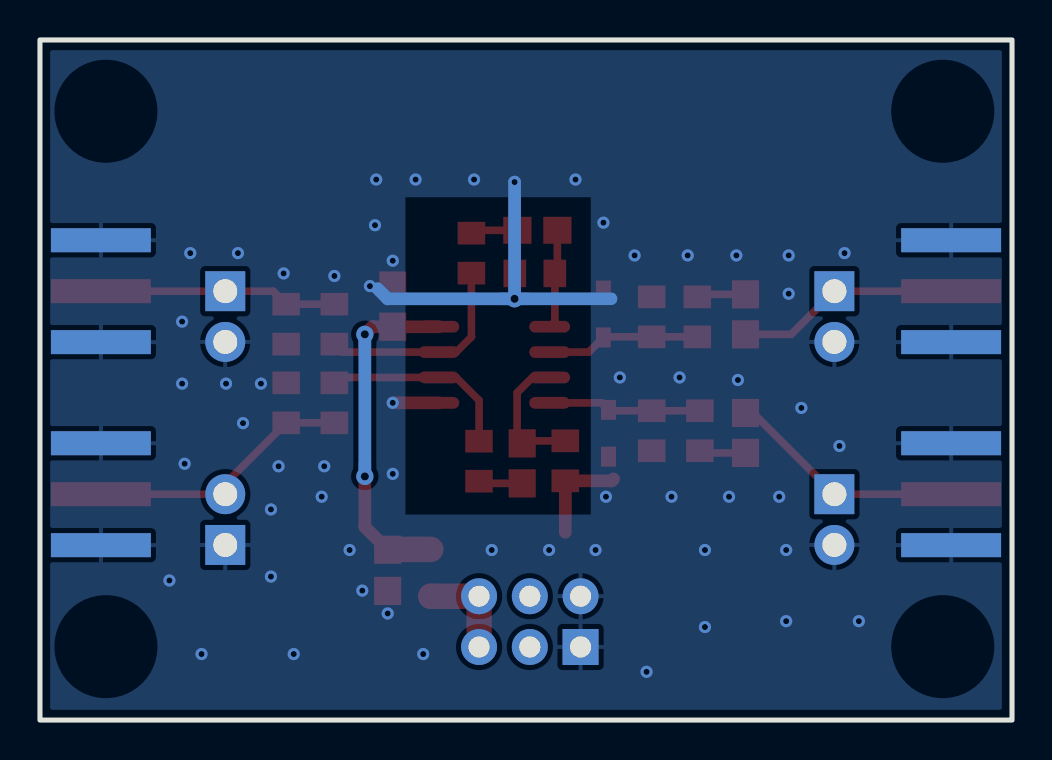
[diagram p4: board, bottom side, seen from below]

Outline 48.64 x 34.04 mm; copper layers: Top Layer, Bottom Layer. Coordinates in mm from the lower left corner of the outline.
Outline path: rectangle 0,34.04 48.64,0
Stack: Top Layer 0.035mm / Dielectric1 1.51mm FR4 er 4.5 / Bottom Layer 0.035mm

## Design rules (mm)
spacing safeClearance (default): track to track 0.152, other pairs 0.152 to 0.3
track width trackWidth (default): min 0.127, default 0.635, max 2.54
differential pair differentialPair (default): width min 0.127, default 0.254, max 2.54; gap min 0.152, default 0.152
via viaSize (default): diameter min 0.5, default 0.61, max 10; hole min 0.3, default 0.305, max 6

## Placement (name value [footprint] x y rotation side)
A输入端  BWSMA-KE-P001  [SMA-SMD_BWSMA-KE-P001]  3.05 21.46 180 top
A输出端  BWSMA-KE-P001  [SMA-SMD_BWSMA-KE-P001]  45.59 21.46 0 top
B输入端  BWSMA-KE-P001  [SMA-SMD_BWSMA-KE-P001]  3.05 11.3 180 top
B输出端  BWSMA-KE-P001  [SMA-SMD_BWSMA-KE-P001]  45.59 11.3 0 top
C1  1uF  [C0805#2]  13.34 20.3 90 top
C2  1uF  [C0805#2]  13.34 14.37 270 top
C3  30PF  [C0805#2]  23.75 24.51 0 top
C5  30PF  [C0805#2]  24.51 12.84 270 top
C6  10uf  [C0805]  31.24 7.49 90 top
C10  100Nf  [C0805]  30.99 20.72 270 top
D1  BAS40WS 43  [SOD-323_L1.8-W1.3-LS2.5-RD]  20.45 20.32 90 top
D2  BAS40WS 43  [SOD-323_L1.8-W1.3-LS2.5-RD]  20.19 14.35 270 top
D5  BAS40WS 43  [SOD-323_L1.8-W1.3-LS2.5-RD]  29.08 7.37 270 top
G  -  [HDR-TH_2P-P2.54-V-M]  8.89 10.03 270 top
G#2  -  [HDR-TH_2P-P2.54-V-M]  39.37 20.19 270 top
G#3  -  [HDR-TH_2P-P2.54-V-M]  39.37 10.03 90 top
G#4  -  [HDR-TH_2P-P2.54-V-M]  8.89 20.19 270 top
GND +5V  2.54-2*3P针  [HDR-TH_6P-P2.54-V-M-R2-C3-S2.54-1]  24.13 4.93 0 top
R1  30kΩ  [R0805]  18.03 20.18 270 top
R2  0Ω  [R0805]  15.75 20.18 90 top
R3  0Ω  [R0805]  15.62 14.48 270 top
R4  30kΩ  [R0805]  18.03 14.48 90 top
R6  3KΩ  [R0805]  33.91 19.81 90 top
R7  3KΩ  [R0805]  33.91 15.88 270 top
R8  1kΩ  [R0805]  27.05 23.37 270 top
R9  50Ω  [R0805]  23.88 22.35 180 top
R10  2kΩ  [R0805]  36.32 19.81 90 top
R16  1kΩ  [R0805]  26.67 12.95 90 top
R17  50Ω  [R0805]  22.35 12.97 90 top
R18  2kΩ  [R0805]  36.32 15.88 270 top
TLV3502  TLV3502AIDR  [SOIC-8_L4.9-W3.9-P1.27-LS6.0-BL]  25.91 17.78 270 top

## Footprints (pads in the part's own frame, mm; a bottom-side part is the same pattern mirrored in y, then rotated)
C0805
  rect 1.41x1.35 smd: 1(-1.03,0) 2(1.03,0)
C0805#2
  rect 1.41x1.35 smd: 1(-1,0) 2(1,0)
HDR-TH_2P-P2.54-V-M
  rect 2x2 hole 1.2: 1(-1.27,0)
  round 2 hole 1.2: 2(1.27,0)
HDR-TH_6P-P2.54-V-M-R2-C3-S2.54-1
  rect 1.8x1.8 hole 1.05: 1(-2.54,-1.27)
  round 1.8 hole 1.05: 2(-2.54,1.27) 3(0,-1.27) 4(0,1.27) 5(2.54,-1.27) 6(2.54,1.27)
R0805
  rect 1.133x1.377 smd: 1(-1,0) 2(1,0)
SMA-SMD_BWSMA-KE-P001
  rect 5x1.2 smd: 1(0,-2.55) 2(0,2.55) 5(0,0)
  rect 5x1.2 smd far side: 3(0,2.55) 4(0,-2.55)
SOD-323_L1.8-W1.3-LS2.5-RD
  rect 1x0.75 smd: 1(-1.173,0) 2(1.173,0)
SOIC-8_L4.9-W3.9-P1.27-LS6.0-BL
  oval 0.588x2.045 smd: 1(-1.905,-2.772) 2(-0.635,-2.772) 3(0.635,-2.772) 4(1.905,-2.772) 5(1.905,2.772) 6(0.635,2.772) 7(-0.635,2.772) 8(-1.905,2.772)

## Nets
+5V: C6.2 C10.2 D5.1 TLV3502.8
GND: A输入端.1 A输入端.2 A输入端.3 A输入端.4 A输出端.1 A输出端.2 A输出端.3 A输出端.4 B输入端.1 B输入端.2 B输入端.3 B输入端.4 B输出端.1 B输出端.2 B输出端.3 B输出端.4 C6.1 C10.1 D1.2 D2.2 G.2 G#2.2 G#3.1 G#4.2 GND +5V.1 GND +5V.2 R1.1 R4.1 R9.1 R10.1 R17.1 R18.1 TLV3502.5
INB+: C5.1 R17.2 TLV3502.3
OUTB: R7.1 R16.2 TLV3502.6
$1N930: A输入端.5 C1.1 G#4.1
$1N945: C1.2 R2.2
$1N1296: B输入端.5 C2.1 G.1
$1N1315: C2.2 R3.2
$1N1352: D2.1 R3.1 R4.2 TLV3502.4
$1N6463: A输出端.5 G#2.1 R6.2 R10.2
$1N6592: B输出端.5 G#3.2 R7.2 R18.2
$1N10805: D5.2 GND +5V.5 GND +5V.6
$1N12763: D1.1 R1.2 R2.1 TLV3502.2
$1N14361: C3.1 R9.2 TLV3502.1
$1N14477: C3.2 R8.1
$1N14557: R6.1 R8.2 TLV3502.7
$1N15857: C5.2 R16.1

Pads without a net: GND +5V 3 4

## Via types
v1: diameter 0.864, hole 0.406, Top Layer to Bottom Layer, 3 vias
v2: diameter 0.61, hole 0.305, Top Layer to Bottom Layer, 57 vias

## Routing (per net, layer and track width the routed paths; a pad name or vN(x,y) marks a point on that pad's centre or on a via; arc(x,y) is an arc through that point)
+5V: length 17.3
  Top Layer w0.635: C6.2 32.38,9.67 v1(32.38,12.19) ; v1(32.38,19.3) 32,19.69 C10.2 TLV3502.8
  Top Layer w1.27: C6.2 31.23,8.54 D5.1
  Bottom Layer w0.635: v1(32.38,19.3) v1(32.38,12.19)
GND: length 26.3
  Top Layer w0.635: 22.35,9.4 R17.1 20.03,11.97 19.94,12.06 ; R9.1 24.89,22.34 v1(24.89,21.08) ; v2(30.99,15.88) TLV3502.5
  Bottom Layer w0.635: v1(24.89,21.08) v2(24.89,26.92) ; v1(24.89,21.08) 31.24,21.08 31.75,21.59 ; v1(24.89,21.08) 20.07,21.08
  vias: v2(7.67,4.95) v2(8.38,23.37) v2(8.64,13.72) v2(10.54,15.62) v2(11.18,23.25) v2(11.18,21.34) v2(11.3,8.51) v2(11.3,4.95) v2(11.65,11.18) v2(13.72,17.02) v2(13.79,23.25) v2(14.16,11.18) v2(15.37,8.51) v2(15.37,4.65) v2(16.23,23.25) v2(16.64,17.14) v2(17.04,11.18) v2(18.29,2.41) v2(18.89,23.25) v2(19.63,17.14) v2(20.32,11.18) v2(20.45,24.89) v2(20.84,8.51) v2(21.84,27.05) v2(23.17,8.51) v2(26.03,8.51) v2(26.92,27.05) v2(29.46,3.3) v2(29.84,27.05) v2(30.99,22.99) v2(30.99,12.32) v2(31.24,5.33) v2(31.82,27.05) v2(31.88,24.77) v2(32.13,21.72) v2(32.51,6.48) v2(33.15,8.51) v2(33.91,22.23) v2(34.42,12.7) v2(34.54,11.18) v2(35.94,3.3) v2(36.45,22.35) v2(36.7,12.7) v2(37.08,10.54) v2(37.08,7.18) v2(37.58,16.84) v2(38.48,14.86) v2(38.74,23.37) v2(39.33,16.84) v2(40.56,3.3) v2(41.12,23.37) v2(41.4,12.83) v2(41.53,19.94) v2(41.53,16.84) v2(42.16,6.98)
INB+: length 6.8
  Top Layer w0.381: TLV3502.3 24,17.14 24.77,16.38 24.77,14.1 C5.1 24.38,13.97 R17.2
OUTB: length 9.9
  Top Layer w0.381: R7.1 33.64,17.14 TLV3502.6 27.81,17.14 26.67,16 R16.2
$1N930: length 11.2
  Top Layer w0.381: C1.1 11.05,19.3 8.89,21.46 A输入端.5
$1N945: length 2.5
  Top Layer w0.381: C1.2 15.62,21.3 R2.2
$1N1296: length 12
  Top Layer w0.381: B输入端.5 G.1 12.95,15.37 C2.1
$1N1315: length 2.3
  Top Layer w0.381: R3.2 15.51,13.37 C2.2
$1N1352: length 7.7
  Top Layer w0.381: TLV3502.4 20.54,15.88 D2.1 20.15,15.48 R4.2 R3.1
$1N6463: length 12
  Top Layer w0.381: A输出端.5 36.97,21.46 R10.2 R6.2
$1N6592: length 13.5
  Top Layer w0.381: B输出端.5 G#3.2 39.37,11.83 R18.2 R7.2
$1N10805: length 5
  Top Layer w1.27: GND +5V.5 GND +5V.6 29.08,6.2 D5.2
$1N12763: length 7.7
  Top Layer w0.381: R2.1 R1.2 20.42,19.18 D1.1 21.18,18.42 TLV3502.2
$1N14361: length 5
  Top Layer w0.381: TLV3502.1 22.88,19.94 R9.2 22.75,22.48 C3.1
$1N14477: length 2.4
  Top Layer w0.381: R8.1 26.91,24.51 C3.2
$1N14557: length 10.5
  Top Layer w0.381: R8.2 27.05,19.18 27.81,18.42 TLV3502.7 33.51,18.42 R6.1
$1N15857: length 2.2
  Top Layer w0.381: R16.1 26.56,11.84 C5.2

## Copper pours and planes (outline as drawn; the poured copper is in the pictures)
GND on Top Layer: 0.13,33.91 48.51,33.91 48.51,0.13 0.13,0.13
GND on Bottom Layer: 0.13,33.91 48.51,33.91 48.51,0.13 0.13,0.13

Small or netless copper shapes (teardrops, artwork), in the pictures only: 64 on Top Layer, 5 on Bottom Layer

## Text on the board
Top Silkscreen Layer: TLV3502 | 双路过零比较器

# Board PCB3
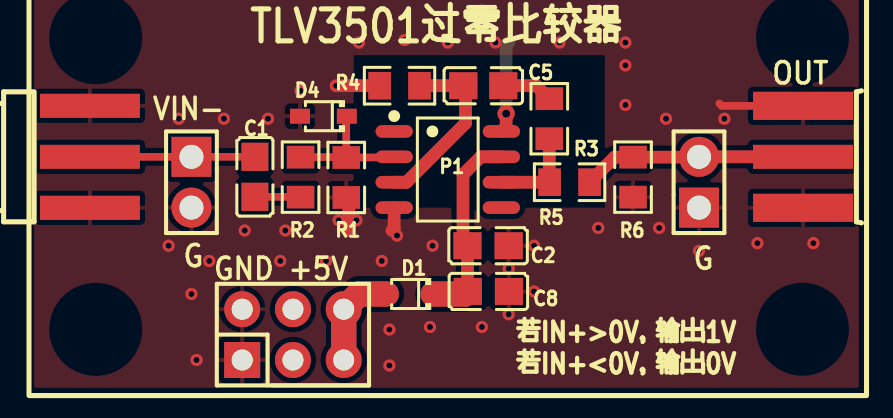
[diagram p5: board, top side]
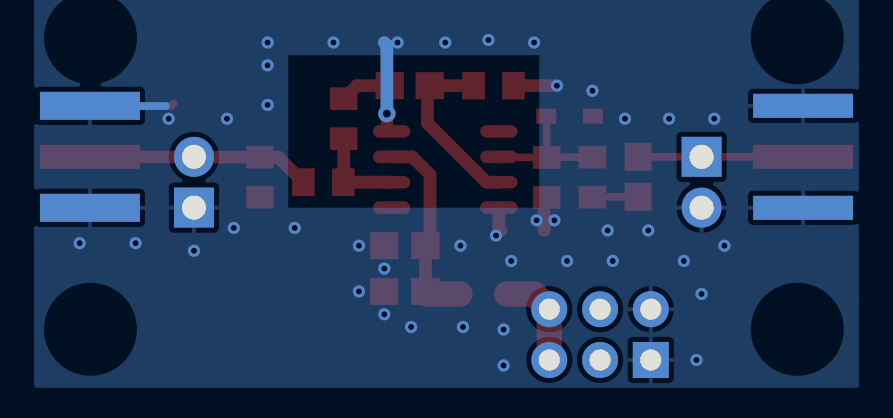
[diagram p6: board, bottom side, seen from below]

No outline. copper layers: Top Layer, Bottom Layer. Coordinates in mm from the lowest, leftmost part position.
Stack: Top Layer 0.035mm / Dielectric1 1.51mm FR4 er 4.5 / Bottom Layer 0.035mm

## Design rules (mm)
spacing safeClearance (default): track to track 0.152, other pairs 0.152 to 0.3
track width trackWidth (default): min 0.127, default 0.254, max 2.54
differential pair differentialPair (default): width min 0.127, default 0.254, max 2.54; gap min 0.152, default 0.152
via viaSize (default): diameter min 0.5, default 0.61, max 10; hole min 0.3, default 0.305, max 6

## Placement (name value [footprint] x y rotation side)
C1  1uF  [C0805]  8.26 7.89 270 top
C2  100Nf  [C0805#2]  19.93 4.44 180 top
C5  30PF  [C0805]  19.69 12.45 0 top
C8  10uf  [C0805#2]  19.94 2.16 180 top
D1  BAS40WS 43  [SOD-323_L1.8-W1.3-LS2.5-RD]  16 2.03 180 top
D4  BAS40WS 43  [SOD-323_L1.8-W1.3-LS2.5-RD]  11.68 10.92 180 top
G  -  [HDR-TH_2P-P2.54-V-M]  30.48 7.62 90 top
G#2  -  [HDR-TH_2P-P2.54-V-M]  5.08 7.62 270 top
GND +5V  2.54-2*3P针  [HDR-TH_6P-P2.54-V-M-R2-C3-S2.54-1]  10.16 0 0 top
OUT  KH-SMA-KE8-G  [CONN-SMD_KH-SMA-KE8-G]  35.69 8.89 270 top
P1  TLV3501AIDR  [SOP-8_L4.9-W3.9-P1.27-LS6.0-BL]  17.91 8.25 270 top
R1  30kΩ  [R0805]  12.83 7.86 90 top
R2  0Ω  [R0805]  10.54 7.87 270 top
R3  1kΩ  [R0805]  22.99 10.79 270 top
R4  50Ω  [R0805]  15.49 12.45 0 top
R5  4kΩ  [R0805]  24 7.62 0 top
R6  1kΩ  [R0805]  27.18 7.87 90 top
VIN-  BWSMA-KE-P001  [SMA-SMD_BWSMA-KE-P001]  0 8.89 180 top

## Footprints (pads in the part's own frame, mm; a bottom-side part is the same pattern mirrored in y, then rotated)
C0805
  rect 1.41x1.35 smd: 1(-1,0) 2(1,0)
C0805#2
  rect 1.41x1.35 smd: 1(-1.03,0) 2(1.03,0)
CONN-SMD_KH-SMA-KE8-G
  rect 1.4x5 smd: 1(-2.55,0) 2(2.55,0)
  rect 1.4x5 smd far side: 3(-2.55,0) 4(2.55,0)
  rect 1.2x5 smd: 5(0,0)
HDR-TH_2P-P2.54-V-M
  rect 2x2 hole 1.2: 1(-1.27,0)
  round 2 hole 1.2: 2(1.27,0)
HDR-TH_6P-P2.54-V-M-R2-C3-S2.54-1
  rect 1.8x1.8 hole 1.05: 1(-2.54,-1.27)
  round 1.8 hole 1.05: 2(-2.54,1.27) 3(0,-1.27) 4(0,1.27) 5(2.54,-1.27) 6(2.54,1.27)
R0805
  rect 1.133x1.377 smd: 1(-1,0) 2(1,0)
SMA-SMD_BWSMA-KE-P001
  rect 5x1.2 smd: 1(0,-2.55) 2(0,2.55) 5(0,0)
  rect 5x1.2 smd far side: 3(0,2.55) 4(0,-2.55)
SOD-323_L1.8-W1.3-LS2.5-RD
  rect 1x0.75 smd: 1(-1.173,0) 2(1.173,0)
SOP-8_L4.9-W3.9-P1.27-LS6.0-BL
  oval 0.63x1.865 smd: 1(-1.905,-2.683) 2(-0.635,-2.683) 3(0.635,-2.683) 4(1.905,-2.683) 5(1.905,2.683) 6(0.635,2.683) 7(-0.635,2.683) 8(-1.905,2.683)

## Nets
+5V: C2.2 C8.2 D1.1 P1.7
GND: C2.1 C8.1 D4.2 G.1 G#2.2 GND +5V.1 GND +5V.2 OUT.1 OUT.2 OUT.3 OUT.4 P1.4 P1.8 R1.1 R4.1 R6.1 VIN-.1 VIN-.2 VIN-.3 VIN-.4
$1N1067: C1.1 G#2.1 VIN-.5
$1N1068: C1.2 R2.2
$1N1077: D1.2 GND +5V.5 GND +5V.6
$1N1963: D4.1 P1.2 R1.2 R2.1
$1N2302: C5.2 R3.1
$1N2385: C5.1 P1.3 R4.2
$1N2597: P1.6 R3.2 R5.1
$1N2727: G.2 OUT.5 R5.2 R6.2

Pads without a net: GND +5V 3 4; P1 1 5

## Via types
v1: diameter 0.61, hole 0.305, Top Layer to Bottom Layer, 41 vias
v2: diameter 0.864, hole 0.406, Top Layer to Bottom Layer, 1 via

## Routing (per net, layer and track width the routed paths; a pad name or vN(x,y) marks a point on that pad's centre or on a via; arc(x,y) is an arc through that point)
+5V: length 10
  Top Layer w0.635: C8.2 18.9,2.17 C2.2 18.67,4.67 18.67,8 19.56,8.89 P1.7
  Top Layer w1.27: D1.1 18.78,2.03 C8.2
GND: length 17.7
  Top Layer w0.381: OUT.1 31.61,11.44 31.5,11.56
  Top Layer w0.635: 12.83,6.86 12.95,6.73 12.95,5.21 ; v2(20.83,11.05) 20.83,10.4 P1.8 ; R4.1 v1(12.32,12.45) ; P1.4 15.22,5.32 15.11,5.21
  Bottom Layer w0.381: OUT.1 35.68,11.43 31.88,11.43
  Bottom Layer w0.635: v2(20.83,11.05) 20.83,14.48 20.96,14.6
  vias: v1(3.94,4.44) v1(4.45,10.79) v1(5.08,2.03) v1(5.33,-1.27) v1(5.97,3.68) v1(6.71,10.79) v1(7.75,5.21) v1(8.91,10.79) v1(9.53,3.68) v1(9.78,5.21) v1(10.54,12.19) v1(11.81,3.68) v1(12.45,5.71) v1(13.34,5.71) v1(13.46,14.6) v1(14.61,3.68) v1(14.99,0.25) v1(14.99,-1.54) v1(15.37,4.95) v1(15.75,14.73) v1(17.02,0.38) v1(17.15,4.44) v1(17.91,14.6) v1(19.61,0.38) v1(20.3,14.6) v1(20.96,3.3) v1(20.96,1.02) v1(22.23,4.44) v1(22.23,2.16) v1(23.5,14.6) v1(25.44,5.33) v1(26.8,14.6) v1(26.8,13.46) v1(26.8,11.48) v1(28.49,5.33) v1(28.83,10.79) v1(30.48,4.19) v1(31.75,10.79) v1(33.4,4.57) v1(36.2,4.57)
$1N1067: length 8.3
  Top Layer w0.381: C1.1 G#2.1 VIN-.5
$1N1068: length 2.3
  Top Layer w0.381: 10.54,6.87 10.53,6.89 C1.2
$1N1077: length 5
  Top Layer w1.27: 12.7,-1.27 12.7,1.27 13.46,2.03 D1.2
$1N1963: length 6.8
  Top Layer w0.381: P1.2 15.19,8.86 R1.2 ; R1.2 12.83,10.89 D4.1 ; R1.2 12.81,8.87 R2.1
$1N2302: length 2.6
  Top Layer w0.635: R3.1 22.34,12.45 C5.2
$1N2385: length 8.9
  Top Layer w0.635: P1.3 15.84,7.62 18.8,10.57 18.8,12.33 C5.1 R4.2
$1N2597: length 4.6
  Top Layer w0.635: R3.2 22.99,7.64 R5.1 P1.6
$1N2727: length 11.2
  Top Layer w0.635: R5.2 26.26,8.87 R6.2 30.46,8.87 G.2 OUT.5

## Copper pours and planes (outline as drawn; the poured copper is in the pictures)
GND on Top Layer: -2.79,17.65 38.48,17.65 38.48,-2.67 -2.79,-2.67
GND on Bottom Layer: -2.79,17.65 38.48,17.65 38.48,-2.67 -2.79,-2.67

## Text on the board
Top Silkscreen Layer: 若IN+>0V，输出1V / 若IN+<0V，输出0V | TLV3501过零比较器

# Board PCB4
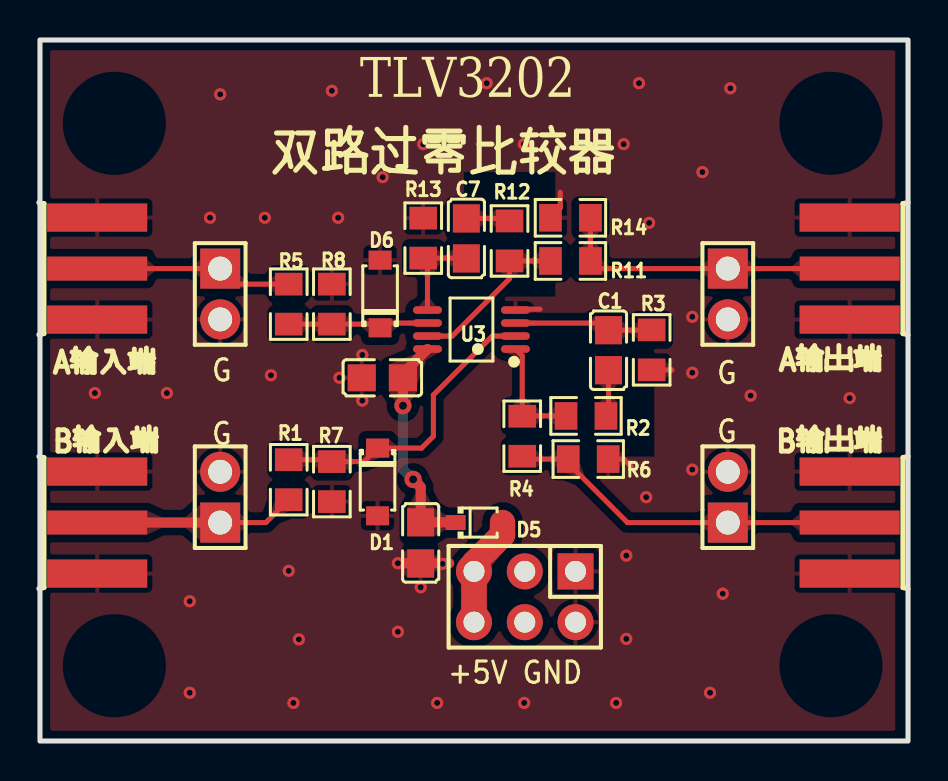
[diagram p7: board, top side]
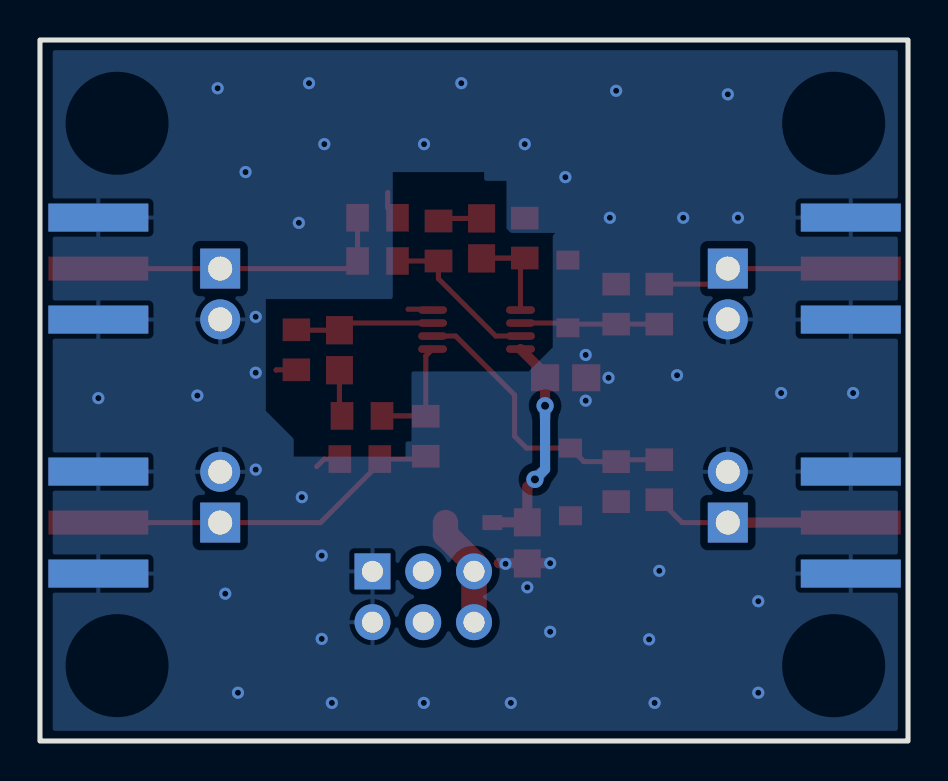
[diagram p8: board, bottom side, seen from below]

Outline 43.43 x 35.05 mm; copper layers: Top Layer, Bottom Layer. Coordinates in mm from the lower left corner of the outline.
Outline path: rectangle 0,35.05 43.43,0
Stack: Top Layer 0.035mm / Dielectric1 1.51mm FR4 er 4.5 / Bottom Layer 0.035mm

## Design rules (mm)
spacing safeClearance (default): track to track 0.152, other pairs 0.152 to 0.3
track width trackWidth (default): min 0.127, default 0.254, max 2.54
differential pair differentialPair (default): width min 0.127, default 0.254, max 2.54; gap min 0.152, default 0.152
via viaSize (default): diameter min 0.5, default 0.61, max 10; hole min 0.3, default 0.305, max 6

## Placement (name value [footprint] x y rotation side)
+5V GND  2.54-2*3P针  [HDR-TH_6P-P2.54-V-M-R2-C3-S2.54-1]  24.26 7.21 180 top
A输入端  BWSMA-KE-P001  [CONN-SMD_KH-SMA-KE8-G]  2.86 23.62 90 top
A输出端  BWSMA-KE-P001  [CONN-SMD_KH-SMA-KE8-G]  40.51 23.62 270 top
B输入端  KH-SMA-KE8-G  [CONN-SMD_KH-SMA-KE8-G]  2.86 10.92 90 top
B输出端  KH-SMA-KE8-G  [CONN-SMD_KH-SMA-KE8-G]  40.51 10.92 270 top
C1  30PF  [C0805#2]  28.45 19.54 270 top
C7  30PF  [C0805#2]  21.34 25.13 90 top
D1  1N5817W  [SOD-123_L2.8-W1.8-LS3.7-RD]  16.89 12.95 270 top
D5  BAS40WS 43  [SOD-323_L1.8-W1.3-LS2.5-RD]  21.97 10.92 0 top
D6  1N5817W  [SOD-123_L2.8-W1.8-LS3.7-RD]  17.02 22.35 90 top
G  -  [HDR-TH_2P-P2.54-V-M]  9.02 22.35 270 top
G#2  -  [HDR-TH_2P-P2.54-V-M]  34.42 22.35 270 top
G#3  -  [HDR-TH_2P-P2.54-V-M]  9.02 12.19 90 top
G#4  -  [HDR-TH_2P-P2.54-V-M]  34.42 12.19 90 top
NOREF  -  [C0805]  19.05 9.91 90 top
NOREF#2  -  [C0805]  17.13 18.16 0 top
R1  50Ω  [R0805]  12.45 13.07 270 top
R2  1kΩ  [R0805]  27.32 16.26 180 top
R3  50Ω  [R0805]  30.61 19.56 90 top
R4  3KΩ  [R0805]  24.13 15.24 270 top
R5  50Ω  [R0805]  12.45 21.84 90 top
R6  2kΩ  [R0805]  27.43 14.1 180 top
R7  50Ω  [R0805]  14.61 12.97 270 top
R8  50Ω  [R0805]  14.61 21.84 90 top
R11  3KΩ  [R0805]  26.54 24 0 top
R12  1kΩ  [R0805]  23.49 25 270 top
R13  50Ω  [R0805]  19.18 25.15 270 top
R14  2kΩ  [R0805]  26.54 26.16 0 top
U3  TLV3202AQDGKRQ1  [VSSOP-8_L3.0-W3.0-P0.65-LS4.9-BL]  21.59 20.57 90 top

## Footprints (pads in the part's own frame, mm; a bottom-side part is the same pattern mirrored in y, then rotated)
C0805
  rect 1.41x1.35 smd: 1(-1.03,0) 2(1.03,0)
C0805#2
  rect 1.41x1.35 smd: 1(-1,0) 2(1,0)
CONN-SMD_KH-SMA-KE8-G
  rect 1.4x5 smd: 1(-2.55,0) 2(2.55,0)
  rect 1.4x5 smd far side: 3(-2.55,0) 4(2.55,0)
  rect 1.2x5 smd: 5(0,0)
HDR-TH_2P-P2.54-V-M
  rect 2x2 hole 1.2: 1(-1.27,0)
  round 2 hole 1.2: 2(1.27,0)
HDR-TH_6P-P2.54-V-M-R2-C3-S2.54-1
  rect 1.8x1.8 hole 1.05: 1(-2.54,-1.27)
  round 1.8 hole 1.05: 2(-2.54,1.27) 3(0,-1.27) 4(0,1.27) 5(2.54,-1.27) 6(2.54,1.27)
R0805
  rect 1.133x1.377 smd: 1(-1,0) 2(1,0)
SOD-123_L2.8-W1.8-LS3.7-RD
  rect 0.95x1.15 smd: 1(-1.692,0) 2(1.692,0)
SOD-323_L1.8-W1.3-LS2.5-RD
  rect 1x0.75 smd: 1(-1.173,0) 2(1.173,0)
VSSOP-8_L3.0-W3.0-P0.65-LS4.9-BL
  oval 0.38x1.45 smd: 1(-0.975,-2.2) 2(-0.325,-2.2) 3(0.325,-2.2) 4(0.975,-2.2) 5(0.975,2.2) 6(0.325,2.2) 7(-0.325,2.2) 8(-0.975,2.2)

## Nets
+5V: D5.1 NOREF.2 NOREF#2.2 U3.8
GND: +5V GND.1 +5V GND.2 A输入端.1 A输入端.2 A输入端.3 A输入端.4 A输出端.1 A输出端.2 A输出端.3 A输出端.4 B输入端.1 B输入端.2 B输入端.3 B输入端.4 B输出端.1 B输出端.2 B输出端.3 B输出端.4 D1.2 D6.2 G.2 G#2.2 G#3.2 G#4.2 NOREF.1 NOREF#2.1 R3.1 R6.1 R7.2 R8.2 R13.1 R14.1 U3.4
$1N1457: +5V GND.5 +5V GND.6 D5.2
$1N3734: C7.2 R12.1
$1N4106: C7.1 R13.2 U3.5
$1N4185: R11.1 R12.2 U3.7
$1N4362: A输入端.5 G.1 R5.2
$1N4792: A输出端.5 G#2.1 R11.2 R14.2
$1N5698: C1.2 R2.1
$1N5699: C1.1 R3.2 U3.3
$1N5700: R2.2 R4.1 U3.1
$1N5701: B输入端.5 G#3.1 R1.2
$1N5704: B输出端.5 G#4.1 R4.2 R6.2
$1N6411: D1.1 R1.1 R7.1 U3.2
$1N6737: D6.1 R5.1 R8.1 U3.6

Pads without a net: +5V GND 3 4

## Via types
v1: diameter 0.864, hole 0.406, Top Layer to Bottom Layer, 2 vias
v2: diameter 0.61, hole 0.305, Top Layer to Bottom Layer, 42 vias

## Routing (per net, layer and track width the routed paths; a pad name or vN(x,y) marks a point on that pad's centre or on a via; arc(x,y) is an arc through that point)
+5V: length 11.3
  Top Layer w0.508: v1(18.16,16.76) NOREF#2.2 18.16,18.37 U3.8 ; v1(18.67,13.08) 19.05,12.7 NOREF.2 20.78,10.94 D5.1
  Bottom Layer w0.508: v1(18.16,16.76) 18.16,13.59 v1(18.67,13.08)
GND: length 7.6
  Top Layer w0.254: U3.4 23.83,21.59 25.02,21.59 ; 31.62,18.54 31.61,18.56 R3.1 ; R6.1 29.21,14.1 29.59,13.72 ; R14.1 26.04,26.65 26.04,27.43
  Top Layer w0.508: 20.48,8.89 v2(17.91,8.89)
  vias: v2(2.75,17.4) v2(6.35,17.4) v2(7.49,6.99) v2(7.49,2.41) v2(8.51,26.16) v2(9.02,32.34) v2(11.25,26.16) v2(11.56,18.29) v2(12.45,8.51) v2(12.68,1.91) v2(12.95,5.08) v2(14.61,32.51) v2(14.92,26.16) v2(14.99,18.16) v2(16.13,19.3) v2(16.13,17.02) v2(17.14,28.19) v2(17.91,5.46) v2(19.05,7.69) v2(19.18,29.85) v2(19.87,1.91) v2(20.14,8.86) v2(22.35,32.89) v2(24.22,29.85) v2(24.23,1.91) v2(28.83,1.91) v2(29.21,29.85) v2(29.34,9.27) v2(29.34,5.11) v2(29.97,32.89) v2(30.33,12.19) v2(30.48,25.91) v2(32.64,21.21) v2(32.64,18.42) v2(32.64,13.57) v2(33.15,28.45) v2(33.53,2.41) v2(34.16,7.37) v2(34.54,32.64) v2(35.56,17.27) v2(40.51,17.15)
$1N1457: length 5.6
  Top Layer w1.27: D5.2 23.14,10.32 21.72,8.89 +5V GND.5 +5V GND.6
$1N3734: length 2.2
  Top Layer w0.254: R12.1 23.37,26.13 C7.2
$1N4106: length 4.9
  Top Layer w0.254: U3.5 19.39,23.93 R13.2 21.32,24.15 C7.1
$1N4185: length 8.3
  Top Layer w0.254: 23.67,24 23.49,23.83 23.49,23.11 20.63,20.25 U3.7 ; 23.67,24 R12.2 ; 23.67,24 R11.1
$1N4362: length 9.9
  Top Layer w0.254: R5.2 9.8,22.84 G.1 A输入端.5
$1N4792: length 15.3
  Top Layer w0.254: R14.2 R11.2 27.92,23.62 G#2.1 A输出端.5
$1N5698: length 2.3
  Top Layer w0.254: C1.2 28.45,16.38 R2.1
$1N5699: length 7.1
  Top Layer w0.254: 28.61,20.54 28.25,20.9 U3.3 ; 28.61,20.54 C1.1 ; 28.61,20.54 30.59,20.54 R3.2
$1N5700: length 5.7
  Top Layer w0.254: U3.1 24.13,19.26 R4.1 24.15,16.26 R2.2
$1N5701: length 10.1
  Top Layer w0.254: R1.2 11.3,10.92 G#3.1
  Top Layer w0.508: B输入端.5 G#3.1
$1N5704: length 18
  Top Layer w0.254: B输出端.5 G#4.1 29.4,10.92 26.22,14.1 ; 26.22,14.1 24.27,14.1 R4.2 ; 26.22,14.1 R6.2
$1N6411: length 15.2
  Top Layer w0.254: U3.2 22.63,20.25 19.68,17.3 19.68,15.24 19.09,14.65 D1.1 16.21,13.97 R7.1 14.51,14.07 R1.1
$1N6737: length 7.1
  Top Layer w0.254: R5.1 R8.1 16.83,20.84 D6.1 17.26,20.9 U3.6

## Copper pours and planes (outline as drawn; the poured copper is in the pictures)
GND on Top Layer: 0.51,34.54 42.8,34.54 42.8,0.51 0.51,0.51
GND on Bottom Layer: 0.51,34.54 42.8,34.54 42.8,0.51 0.51,0.51

Small or netless copper shapes (teardrops, artwork), in the pictures only: 68 on Top Layer, 2 on Bottom Layer

## Text on the board
Top Silkscreen Layer: TLV3202 | 双路过零比较器
